# EAGLE schematic ngptv (EAGLE 8.3.2)
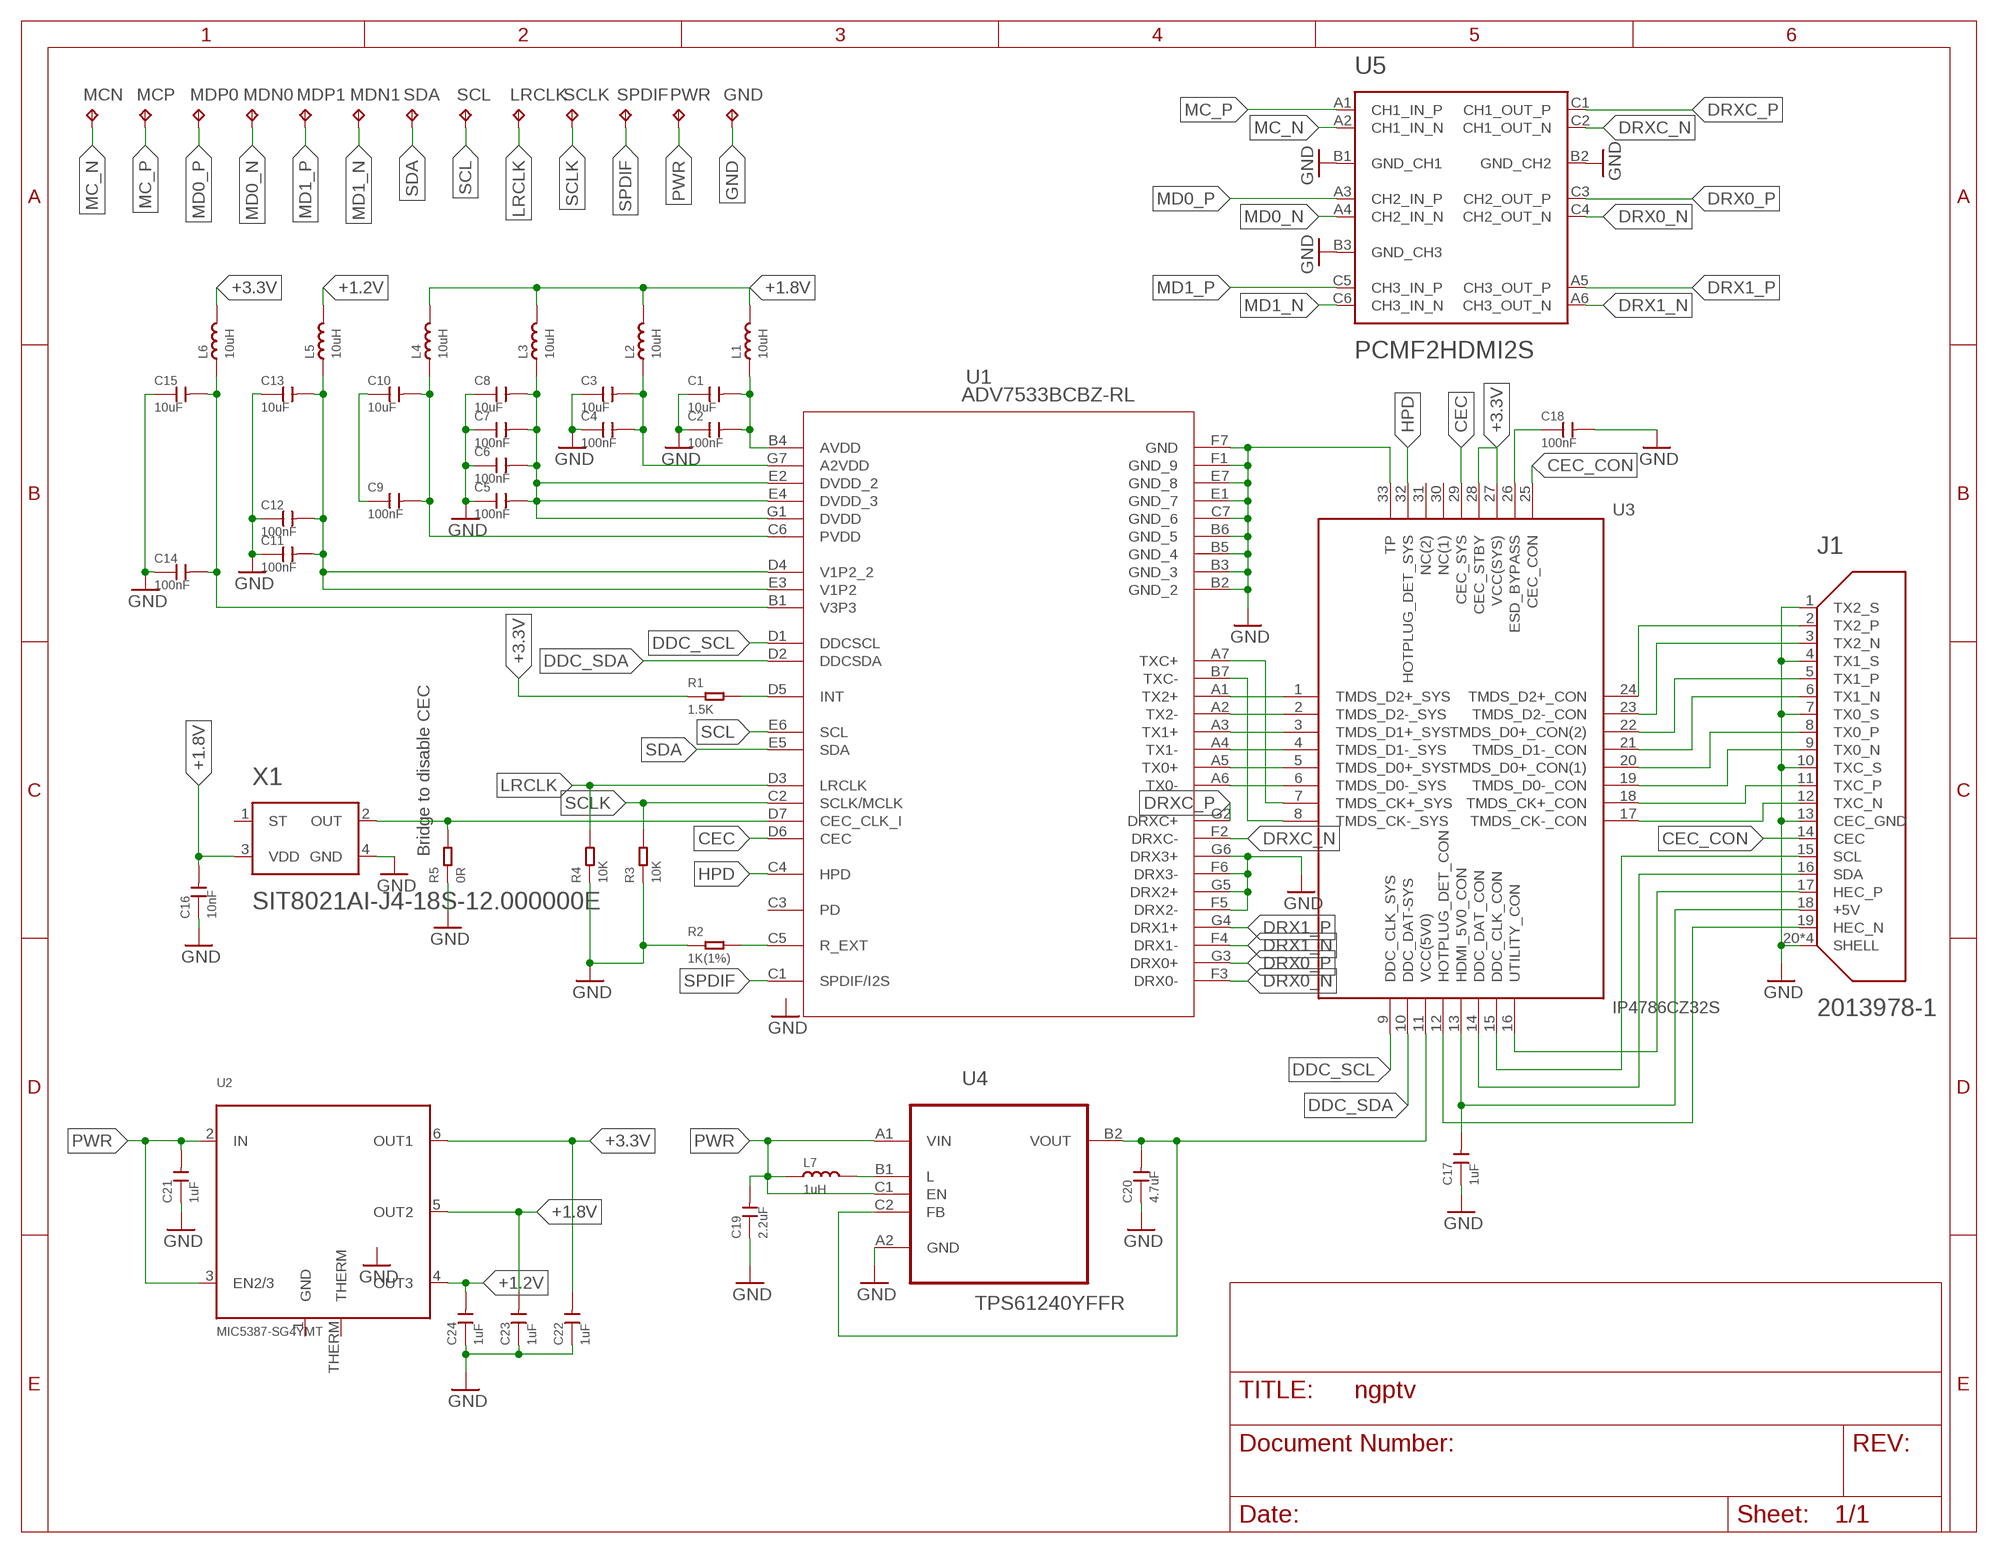
[diagram p0: schematic, sheet 1]

## Parts
C1  10uF  CERAMIC-10UF-6.3V-20%-X5R(0402)  [C0402]
C2  100nF  CERAMIC-10UF-6.3V-20%-X5R(0402)  [C0402]
C3  10uF  CERAMIC-10UF-6.3V-20%-X5R(0402)  [C0402]
C4  100nF  CERAMIC-10UF-6.3V-20%-X5R(0402)  [C0402]
C5  100nF  CERAMIC-10UF-6.3V-20%-X5R(0402)  [C0402]
C6  100nF  CERAMIC-10UF-6.3V-20%-X5R(0402)  [C0402]
C7  100nF  CERAMIC-10UF-6.3V-20%-X5R(0402)  [C0402]
C8  10uF  CERAMIC-10UF-6.3V-20%-X5R(0402)  [C0402]
C9  100nF  CERAMIC-10UF-6.3V-20%-X5R(0402)  [C0402]
C10  10uF  CERAMIC-10UF-6.3V-20%-X5R(0402)  [C0402]
C11  100nF  CERAMIC-10UF-6.3V-20%-X5R(0402)  [C0402]
C12  100nF  CERAMIC-10UF-6.3V-20%-X5R(0402)  [C0402]
C13  10uF  CERAMIC-10UF-6.3V-20%-X5R(0402)  [C0402]
C14  100nF  CERAMIC-10UF-6.3V-20%-X5R(0402)  [C0402]
C15  10uF  CERAMIC-10UF-6.3V-20%-X5R(0402)  [C0402]
C16  10nF  CERAMIC-10UF-6.3V-20%-X5R(0402)  [C0402]
C17  1uF  CERAMIC-1UF-6.3V-10%-X5R(0402)  [C0402]
C18  100nF  CERAMIC-1UF-6.3V-10%-X5R(0402)  [C0402]
C19  2.2uF  CERAMIC-2.2NF-50V-10%-X7R(0402)  [C0402]
C20  4.7uF  CERAMIC-4.7UF-6.3V-20%-X5R(0402)  [C0402]
C21  1uF  CERAMIC-1UF-6.3V-10%-X5R(0402)  [C0402]
C22  1uF  CERAMIC-1UF-6.3V-10%-X5R(0402)  [C0402]
C23  1uF  CERAMIC-1UF-6.3V-10%-X5R(0402)  [C0402]
C24  1uF  CERAMIC-1UF-6.3V-10%-X5R(0402)  [C0402]
GND  TPTP12R  [TP12R]
J1  2013978-1  [DIP-SMT]
L1  10uH  SMD-FERRITE-CHIP-120-OHM-500MA(0603)  [L0603]
L2  10uH  SMD-FERRITE-CHIP-120-OHM-500MA(0603)  [L0603]
L3  10uH  SMD-FERRITE-CHIP-120-OHM-500MA(0603)  [L0603]
L4  10uH  SMD-FERRITE-CHIP-120-OHM-500MA(0603)  [L0603]
L5  10uH  SMD-FERRITE-CHIP-120-OHM-500MA(0603)  [L0603]
L6  10uH  SMD-FERRITE-CHIP-120-OHM-500MA(0603)  [L0603]
L7  1uH  SMD-FERRITE-CHIP-120-OHM-500MA(0603)  [L0603]
LRCLK  TPTP10R  [TP10R]
MCN  TPTP10R  [TP10R]
MCP  TPTP10R  [TP10R]
MDN0  TPTP10R  [TP10R]
MDN1  TPTP10R  [TP10R]
MDP0  TPTP10R  [TP10R]
MDP1  TPTP10R  [TP10R]
PWR  TPTP12R  [TP12R]
R1  1.5K  SMD-RES-1.5K-5%-1/16W(0402)  [R0402]
R2  1K(1%)  SMD-RES-1.5K-5%-1/16W(0402)  [R0402]
R3  10K  SMD-RES-10K-1%-1/16W(0402)  [R0402]
R4  10K  SMD-RES-10K-1%-1/16W(0402)  [R0402]
R5  0R  SMD-RES-0R-5%-1/16W(0402)  [R0402]
SCL  TPTP10R  [TP10R]
SCLK  TPTP10R  [TP10R]
SDA  TPTP10R  [TP10R]
SPDIF  TPTP10R  [TP10R]
U1  ADV7533BCBZ-RL  [CB_49_1]
U2  MIC5387-SG4YMT  VREG_MIC5387  [TMLF-6]
U3  IP4786CZ32S  [QFN40P400X400X50-33N]
U4  TPS61240YFFR  [BGA6C40P2X3_125X85X63]
U5  PCMF2HDMI2S  [WLCSP15]
X1  SIT8021AI-J4-18S-12.000000E  SIT8021  [4-UFBGA]

## Nets
+1.2V: C24.2 L5.2 U2.4(OUT3)
+1.8V: C16.2 C23.2 L1.2 L2.2 L3.2 L4.2 U2.5(OUT2) X1.3(VDD)
+3.3V: C22.2 L6.2 R1.1 U2.6(OUT1) U3.27(VCC(SYS)) U3.28(CEC_STBY)
+5V: C20.2 U3.11(VCC(5V0)) U4.B2(VOUT) U4.C2(FB)
A2VDD: C3.2 C4.2 L2.1 U1.G7(A2VDD)
AVDD: C1.2 C2.2 L1.1 U1.B4(AVDD)
CEC: U1.D6(CEC) U3.29(CEC_SYS)
CEC_CLK: R5.2 U1.D7(CEC_CLK_I) X1.2(OUT)
CEC_CON: J1.14(CEC) U3.25(CEC_CON)
DDC_SCL: U1.D1(DDCSCL) U3.9(DDC_CLK_SYS)
DDC_SDA: U1.D2(DDCSDA) U3.10(DDC_DAT-SYS)
DRX0_N: U1.F3(DRX0-) U5.C4(CH2_OUT_N)
DRX0_P: U1.G3(DRX0+) U5.C3(CH2_OUT_P)
DRX1_N: U1.F4(DRX1-) U5.A6(CH3_OUT_N)
DRX1_P: U1.G4(DRX1+) U5.A5(CH3_OUT_P)
DRXC_N: U1.F2(DRXC-) U5.C2(CH1_OUT_N)
DRXC_P: U1.G2(DRXC+) U5.C1(CH1_OUT_P)
DVDD: C5.2 C6.2 C7.2 C8.2 L3.1 U1.E2(DVDD_2) U1.E4(DVDD_3) U1.G1(DVDD)
GND: C1.1 C2.1 C3.1 C4.1 C5.1 C6.1 C7.1 C8.1 C11.1 C12.1 C13.1 C14.1 C15.1 C16.1 C17.1 C18.2 C19.1 C20.1 C21.1 C22.1 C23.1 C24.1 GND.TP J1.1(TX2_S) J1.4(TX1_S) J1.7(TX0_S) J1.10(TXC_S) J1.13(CEC_GND) J1.20(SHELL) J1.21(SHELL) J1.22(SHELL) J1.23(SHELL) R2.1 R3.1 R4.1 R5.1 U1.B2(GND_2) U1.B3(GND_3) U1.B5(GND_4) U1.B6(GND_5) U1.C7(GND_6) U1.E1(GND_7) U1.E7(GND_8) U1.F1(GND_9) U1.F5(DRX2-) U1.F6(DRX3-) U1.F7(GND) U1.G5(DRX2+) U1.G6(DRX3+) U3.33(TP) U4.A2(GND) U5.B1(GND_CH1) U5.B2(GND_CH2) U5.B3(GND_CH3) X1.4(GND)
HDMI_+5V_CON: C17.2 J1.18(+5V) U3.13(HDMI_5V0_CON)
HPD: U1.C4(HPD) U3.32(HOTPLUG_DET_SYS)
INT: R1.2 U1.D5(INT)
LRCLK: LRCLK.TP R4.2 U1.D3(LRCLK)
MC_N: MCN.TP U5.A2(CH1_IN_N)
MC_P: MCP.TP U5.A1(CH1_IN_P)
MD0_N: MDN0.TP U5.A4(CH2_IN_N)
MD0_P: MDP0.TP U5.A3(CH2_IN_P)
MD1_N: MDN1.TP U5.C6(CH3_IN_N)
MD1_P: MDP1.TP U5.C5(CH3_IN_P)
N$6: J1.2(TX2_P) U3.24(TMDS_D2+_CON)
N$7: C9.1 C10.1
N$8: J1.3(TX2_N) U3.23(TMDS_D2-_CON)
N$9: J1.5(TX1_P) U3.22(TMDS_D0+_CON(2))
N$10: J1.6(TX1_N) U3.21(TMDS_D1-_CON)
N$11: J1.8(TX0_P) U3.20(TMDS_D0+_CON(1))
N$12: J1.9(TX0_N) U3.19(TMDS_D0-_CON)
N$13: J1.11(TXC_P) U3.18(TMDS_CK+_CON)
N$14: J1.12(TXC_N) U3.17(TMDS_CK-_CON)
N$23: J1.15(SCL) U3.15(DDC_CLK_CON)
N$24: J1.16(SDA) U3.14(DDC_DAT_CON)
N$25: J1.17(HEC_P) U3.16(UTILITY_CON)
N$27: J1.19(HEC_N) U3.12(HOTPLUG_DET_CON)
N$29: C18.1 U3.26(ESD_BYPASS)
PVDD: C9.2 C10.2 L4.1 U1.C6(PVDD)
PWR: C19.2 C21.2 L7.1 PWR.TP U2.2(IN) U2.3(EN2/3) U4.A1(VIN) U4.C1(EN)
PWR_L: L7.2 U4.B1(L)
R_EXT: R2.2 U1.C5(R_EXT)
SCL: SCL.TP U1.E6(SCL)
SCLK: R3.2 SCLK.TP U1.C2(SCLK/MCLK)
SDA: SDA.TP U1.E5(SDA)
SPDIF: SPDIF.TP U1.C1(SPDIF/I2S)
TX0_N: U1.A6(TX0-) U3.6(TMDS_D0-_SYS)
TX0_P: U1.A5(TX0+) U3.5(TMDS_D0+_SYS)
TX1_N: U1.A4(TX1-) U3.4(TMDS_D1-_SYS)
TX1_P: U1.A3(TX1+) U3.3(TMDS_D1+_SYS)
TX2_N: U1.A2(TX2-) U3.2(TMDS_D2-_SYS)
TX2_P: U1.A1(TX2+) U3.1(TMDS_D2+_SYS)
TXC_N: U1.B7(TXC-) U3.8(TMDS_CK-_SYS)
TXC_P: U1.A7(TXC+) U3.7(TMDS_CK+_SYS)
V1P2: C11.2 C12.2 C13.2 L5.1 U1.D4(V1P2_2) U1.E3(V1P2)
V3P3: C14.2 C15.2 L6.1 U1.B1(V3P3)
Unconnected: U1.C3(PD) U2.1(GND) U2.THERM U3.30(NC(1)) U3.31(NC(2)) X1.1(ST)

## Notes on the sheet
- Bridge to disable CEC

## Library data of the parts
C1-C16 = Seeed-Capacitor:CERAMIC-10UF-6.3V-20%-X5R(0402): 302010053; MPN: CC0402MRX5R5BB106; VALUE: 10uf
C17 C18 C21-C24 = Seeed-Capacitor:CERAMIC-1UF-6.3V-10%-X5R(0402): 302010003; MPN: CC0402KRX5R5BB105; VALUE: 1UF 6.3V
C19 = Seeed-Capacitor:CERAMIC-2.2NF-50V-10%-X7R(0402): 302010022; MPN: CC0402KRX7R9BB222; VALUE: 2.2nf
C20 = Seeed-Capacitor:CERAMIC-4.7UF-6.3V-20%-X5R(0402): 302010019; MPN: CC0402MRX5R5BB475; VALUE: 4.7uf
GND LRCLK MCN MCP MDN0 MDN1 MDP0 MDP1 PWR SCL SCLK SDA SPDIF = testpad:TP: Test pad
J1 = 2013978-1:2013978-1: HDMI Type C (Mini) Connector
L1-L7 = Seeed-Inductor:SMD-FERRITE-CHIP-120-OHM-500MA(0603): 303030001; MPN: BLM18AG121SN1D; VALUE: 120OHM-500MA
R1 = Seeed-Resistor:SMD-RES-1.5K-5%-1/16W(0402): 301010001; MPN: RC0402JR-071K5L
R2 = Seeed-Resistor:SMD-RES-1.5K-5%-1/16W(0402): 301010001; MPN: RC0402JR-071K5L; VALUE: 1.5K
R3 R4 = Seeed-Resistor:SMD-RES-10K-1%-1/16W(0402): 301010047; MPN: RC0402FR-0710KL; VALUE: 10K 1/16W
R5 = Seeed-Resistor:SMD-RES-0R-5%-1/16W(0402): 301010000; MPN: RC0402JR-070RL
U1 = ADV7533BCBZ-RL:ADV7533BCBZ-RL
U2 = microbuilder:VREG_MIC5387: MIC5387 - Triple Output Linear LDO Regulator 150ma Output on each LDO, 180mV Vf, 2.5-5.5V Input 3.3V, 1.8V, 1.2V - Digikey: 576-3689-1-ND
U3 = IP4786CZ32S:IP4786CZ32S: NXP - IP4786CZ32S - DIODE, ESD, HDMI TX INTERFACE, SOT1318 Source: Datasheet <http://www.farnell.com/datasheets/1927812.pdf>; DESCRIPTION: NXP - IP4786CZ32S - DIODE, ESD, HDMI TX INTERFACE, SOT1318; HEIGHT: 0.5mm; MANUFACTURER_NAME: NXP; MANUFACTURER_PART_NUMBER: IP4786CZ32S; SUPPLIER_NAME: RS
U4 = Texas Instruments_By_element14_Batch_1:TPS61240YFFR: 3.5-MHz High Efficiency Step-Up Converter; MPN: TPS61240YFFR; OC_FARNELL: -; OC_NEWARK: 09R6669; PACKAGE: DSBGA-6; SUPPLIER: Texas Instruments
U5 = PCMFXHDMI2S:PCMF2HDMI2S
X1 = SiT8021:SIT8021